# Altium schematic sheet Ignitor Outputs.SchDoc: RB25DET - Ignitor Outputs
size A4; Address1: Drawn By:; Address2: Dan Visser; DocumentNumber: A; Revision: 0.1; SheetNumber: 8; SheetTotal: 12
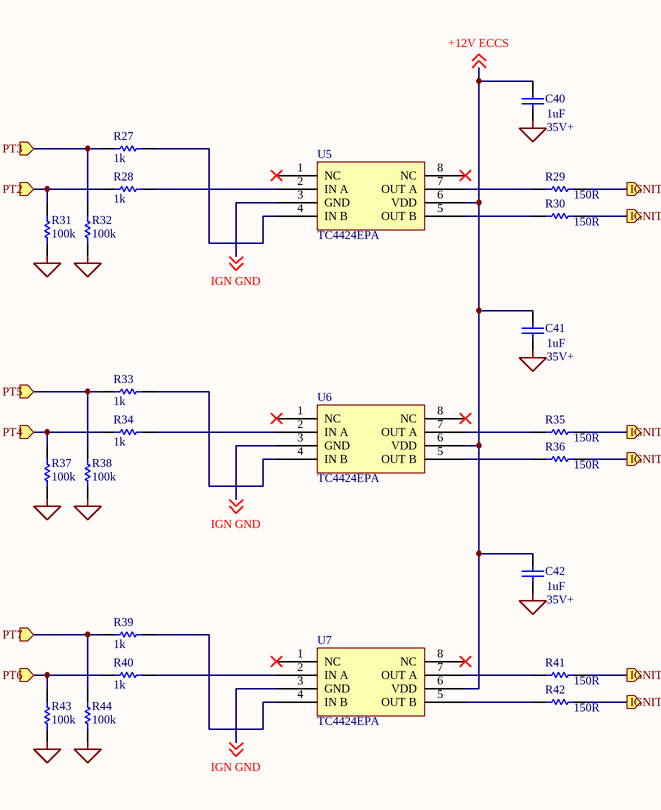
[diagram p0: Ignitor Outputs.SchDoc]

## Parts
C40  value 1uF  [RAD-0.3]
C41  value 1uF  [RAD-0.3]
C42  value 1uF  [RAD-0.3]
R27  value 1k  [AXIAL-0.3]
R28  value 1k  [AXIAL-0.3]
R29  value 150R  [AXIAL-0.3]
R30  value 150R  [AXIAL-0.3]
R31  value 100k  [AXIAL-0.3]
R32  value 100k  [AXIAL-0.3]
R33  value 1k  [AXIAL-0.3]
R34  value 1k  [AXIAL-0.3]
R35  value 150R  [AXIAL-0.3]
R36  value 150R  [AXIAL-0.3]
R37  value 100k  [AXIAL-0.3]
R38  value 100k  [AXIAL-0.3]
R39  value 1k  [AXIAL-0.3]
R40  value 1k  [AXIAL-0.3]
R41  value 150R  [AXIAL-0.3]
R42  value 150R  [AXIAL-0.3]
R43  value 100k  [AXIAL-0.3]
R44  value 100k  [AXIAL-0.3]
U5  TC4424EPA
U6  TC4424EPA
U7  TC4424EPA

## Ports
IGNITOR 1 (out), IGNITOR 2 (out), IGNITOR 3 (out), IGNITOR 4 (out), IGNITOR 5 (out), IGNITOR 6 (out), PT2 (in), PT3 (in), PT4 (in), PT5 (in), PT6 (in), PT7 (in)

## Nets
NetC40_1: C40.1 C41.1 C42.1 R31.1 R32.1 R37.1 R38.1 R43.1 R44.1
+12V ECCS: C40.2 C41.2 C42.2 U5.6(VDD) U6.6(VDD) U7.6(VDD) ; off-sheet +12V ECCS
IGN GND: U5.3(GND) U6.3(GND) U7.3(GND) ; off-sheet IGN GND
IGNITOR 1: R29.2 ; port IGNITOR 1
IGNITOR 2: R30.2 ; port IGNITOR 2
IGNITOR 3: R35.2 ; port IGNITOR 3
IGNITOR 4: R36.2 ; port IGNITOR 4
IGNITOR 5: R41.2 ; port IGNITOR 5
IGNITOR 6: R42.2 ; port IGNITOR 6
PT2: R28.2 R31.2 ; port PT2
PT3: R27.2 R32.2 ; port PT3
PT4: R34.2 R37.2 ; port PT4
PT5: R33.2 R38.2 ; port PT5
PT6: R40.2 R43.2 ; port PT6
PT7: R39.2 R44.2 ; port PT7
NetR27_1: R27.1 U5.4(IN_B)
NetR28_1: R28.1 U5.2(IN_A)
NetR29_1: R29.1 U5.7(OUT_A)
NetR30_1: R30.1 U5.5(OUT_B)
NetR33_1: R33.1 U6.4(IN_B)
NetR34_1: R34.1 U6.2(IN_A)
NetR35_1: R35.1 U6.7(OUT_A)
NetR36_1: R36.1 U6.5(OUT_B)
NetR39_1: R39.1 U7.4(IN_B)
NetR40_1: R40.1 U7.2(IN_A)
NetR41_1: R41.1 U7.7(OUT_A)
NetR42_1: R42.1 U7.5(OUT_B)

Not connected (* = marked no-connect by the designer): U5 1(NC)* 8(NC)*; U6 1(NC)* 8(NC)*; U7 1(NC)* 8(NC)*

## Notes on the sheet
- (near C40) 35V+
- (near C41) 35V+
- (near C42) 35V+
- Title
- Size:
- Date:
- A4
- Number:
- Time:
- Revision:
- Sheet
- of

## Library data of the parts
C40-C42 = Cap: Capacitor; Published: 8-Jun-2000; LatestRevisionDate: 17-Jul-2002; LatestRevisionNote: Re-released for DXP Platform.; PackageReference: RAD-0.3; Publisher: Altium Limited; PackageDescription: Radial Cap, Thru-Hole; 2 Leads; 0.3 in Pin Spacing
R27-R44 = Res1: Resistor; Published: 8-Jun-2000; LatestRevisionDate: 17-Jul-2002; LatestRevisionNote: Re-released for DXP Platform.; PackageReference: AXIAL-0.3; Publisher: Altium Limited; PackageDescription: Axial Device, Thru-Hole; 2 Leads; 0.3 in Pin Spacing
U5-U7 = TC427COA